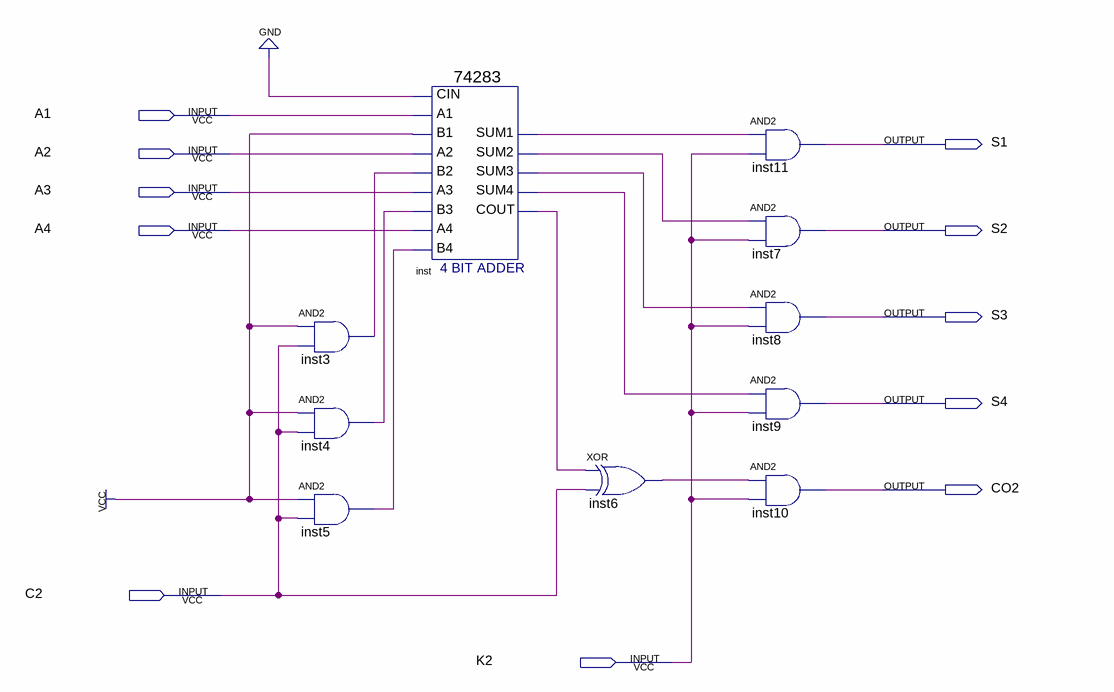
[diagram p0: schematic sheet]
// Quartus schematic Block2.bdf as structural Verilog: 10 symbols, 11 pins
module Block2 (
  input  A1,
  input  A2,
  input  A3,
  input  A4,
  input  C2,
  input  K2,
  output S1,
  output S2,
  output S3,
  output S4,
  output CO2
);

  wire inst3_out, inst4_out, inst5_out, inst6_out, inst_cout, inst_sum1, inst_sum2, inst_sum3, inst_sum4;

  and inst3 (inst3_out, 1'b1, C2);
  and inst4 (inst4_out, 1'b1, C2);
  and inst5 (inst5_out, 1'b1, C2);
  \74283  inst (
    .CIN(1'b0), .A1(A1), .A2(A2), .B2(inst3_out), .A3(A3), .A4(A4), .B4(inst5_out), .B1(1'b1),
    .B3(inst4_out), .SUM4(inst_sum4), .COUT(inst_cout), .SUM1(inst_sum1), .SUM2(inst_sum2), .SUM3(inst_sum3));
  xor inst6 (inst6_out, inst_cout, C2);
  and inst11 (S1, inst_sum1, K2);
  and inst7 (S2, inst_sum2, K2);
  and inst8 (S3, inst_sum3, K2);
  and inst9 (S4, inst_sum4, K2);
  and inst10 (CO2, inst6_out, K2);
endmodule
